# Altium schematic sheet Power.SchDoc
size A; DrawnBy: Ross Harvey; Revision: A; SheetNumber: 6
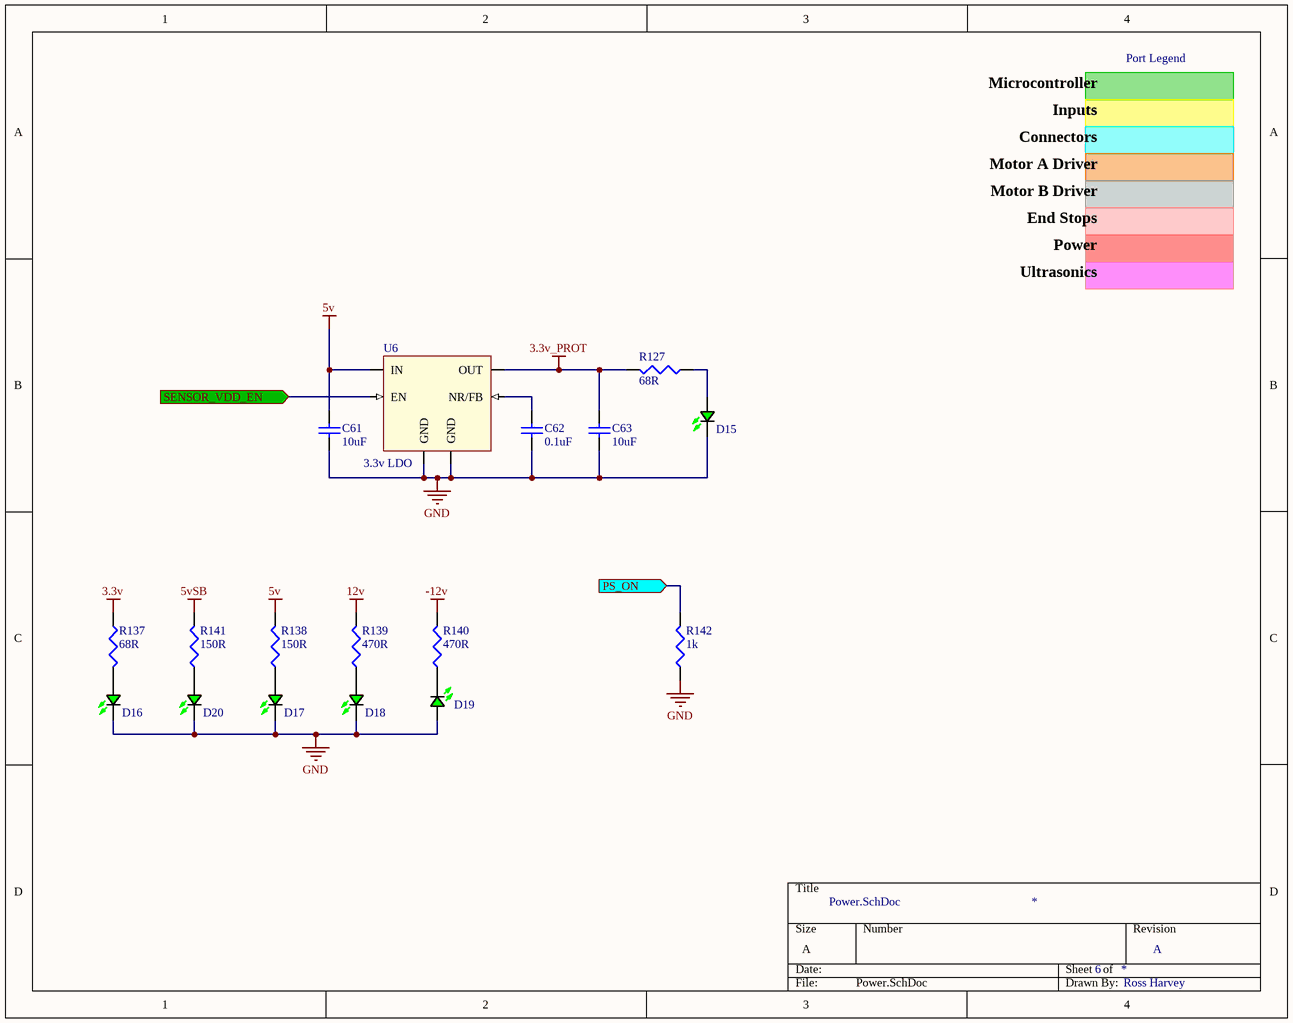
[diagram p0: Power.SchDoc]

## Parts
C61  10uF  [CAP1206R]
C62  0.1uF  [CAP0603W]
C63  10uF  [CAP1206R]
D15  LTST-S270KGKT  [LED Green 0603]  (value not drawn)
D16  LTST-S270KGKT  [LED Green 0603]  (value not drawn)
D17  LTST-S270KGKT  [LED Green 0603]  (value not drawn)
D18  LTST-S270KGKT  [LED Green 0603]  (value not drawn)
D19  LTST-S270KGKT  [LED Green 0603]  (value not drawn)
D20  LTST-S270KGKT  [LED Green 0603]  (value not drawn)
R127  68R  [RES0603W]
R137  68R  [RES0603W]
R138  150R  [RES0603W]
R139  470R  [RES0603W]
R140  470R  [RES0603W]
R141  150R  [RES0603W]
R142  1k  [RES0603W]
U6  3.3v LDO  [SOT-223-6]

## Ports
PS_ON (in), SENSOR_VDD_EN (in)

## Nets
3.3v: R137.1
3.3v_PROT: C63.2 R127.2 U6.2(OUT)
5v: C61.2 R138.2 U6.1(IN)
5vSB: R141.2
12v: R139.2
-12v: R140.2
GND: C61.1 C62.2 C63.1 D15.1(K) D16.1(K) D17.1(K) D18.1(K) D19.2(A) D20.1(K) R142.1 U6.3(GND) U6.6(GND)
PS_ON: R142.2 ; port PS_ON
SENSOR_VDD_EN: U6.5(EN) ; port SENSOR_VDD_EN
NetC62_1: C62.1 U6.4(NR/FB)
NetD15_2: D15.2(A) R127.1
NetD16_2: D16.2(A) R137.2
NetD17_2: D17.2(A) R138.1
NetD18_2: D18.2(A) R139.1
NetD19_1: D19.1(K) R140.1
NetD20_2: D20.2(A) R141.1

## Notes on the sheet
- Microcontroller
- Port Legend
- Inputs
- Connectors
- Motor A Driver
- Motor B Driver
- End Stops
- Power
- Ultrasonics

## Library data of the parts
C61 C63 = 10uF: MFG1_PN: VJ1206V106ZXQTW1BC; MFG1: Vishay; Value: 10uF
C62 = 0.1uF: MFG1_PN: VJ0603Y104JXJPW1BC; MFG1: Vishay; Value: 0.1uF
D15-D20 = LED Green 0603: MFG: Lite On; VFORWARD: 2v; CURRENT: 20mA; COLOR: Green; MFG_PN: LTST-S270KGKT
R127 R137 = 68R (0603): Tolerance: 1%; POWER: 0.1W; MFG_PN: CRCW060368R0FKEB; MFG: Vishay; Load: NL; Value: 68R
R138 R141 = 150R (0603): Tolerance: 1%; POWER: 0.1W; MFG_PN: CRCW0603150RFKEA; MFG: Vishay; Load: NL; Value: 150R
R139 R140 = 470R (0603): Tolerance: 1%; POWER: 0.1W; MFG_PN: CRCW0603470RFKEA; MFG: Vishay; Load: NL; Value: 470R
R142 = 1k (0603): Tolerance: 1%; POWER: 0.1W; MFG_PN: CRCW06031K00FKEA; MFG: Vishay; Load: NL; Value: 1k
U6 = TPS73633DCQR: MFG: TI; MFG_PN: TPS73633DCQR; FUNCTION: 3.3v LDO